# EAGLE design ver1.0 (EAGLE 7.3.0)
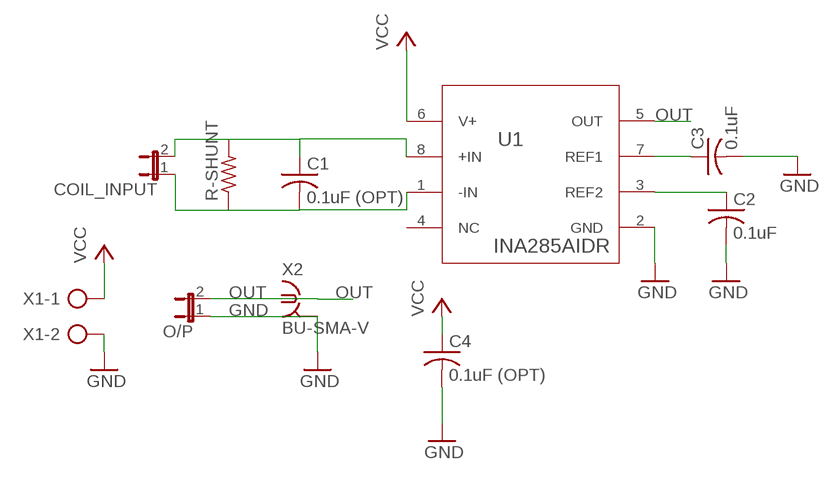
[diagram p0: schematic, sheet 1]

## Parts
C1  0.1uF (OPT)  C-USC0603  [C0603]
C2  0.1uF  C-USC0603  [C0603]
C3  0.1uF  C-USC0603  [C0603]
C4  0.1uF (OPT)  C-USC0603  [C0603]
COIL_INPUT  JP1E  [JP1]
O/P  JP1E  [JP1]
R-SHUNT  R-US_R0603  [R0603]
U1  INA285AIDR  [D0008A_M]
X1  AK500/2  [AK500/2]
X2  BU-SMA-V  [BU-SMA-V]

## Nets
GND: C2.2 C3.2 C4.2 O/P.1 U1.2(GND) X1.2 X2.2 X2.3 X2.4 X2.5
N$1: C2.1 U1.3(REF2)
N$2: C3.1 U1.7(REF1)
N$3: C1.1 COIL_INPUT.2 R-SHUNT.2 U1.8(+IN)
N$4: C1.2 COIL_INPUT.1 R-SHUNT.1 U1.1(-IN)
OUT: O/P.2 U1.5(OUT) X2.1
VCC: C4.1 U1.6(V+) X1.1
Unconnected: U1.4(NC)

## Library data of the parts
C1-C4 = rcl:C-US: CAPACITOR, American symbol
COIL_INPUT O/P = jumper:JP1E: JUMPER
R-SHUNT = rcl:R-US_: RESISTOR, American symbol
U1 = INA285-AID:INA285AIDR
X1 = con-ptr500:AK500/2: CONNECTOR; OC_FARNELL: unknown; OC_NEWARK: unknown
X2 = con-coax:BU-SMA-V: FEMALE SMA CONNECTOR Radiall distributor RS 112-3794; OC_FARNELL: unknown; OC_NEWARK: unknown

## Board
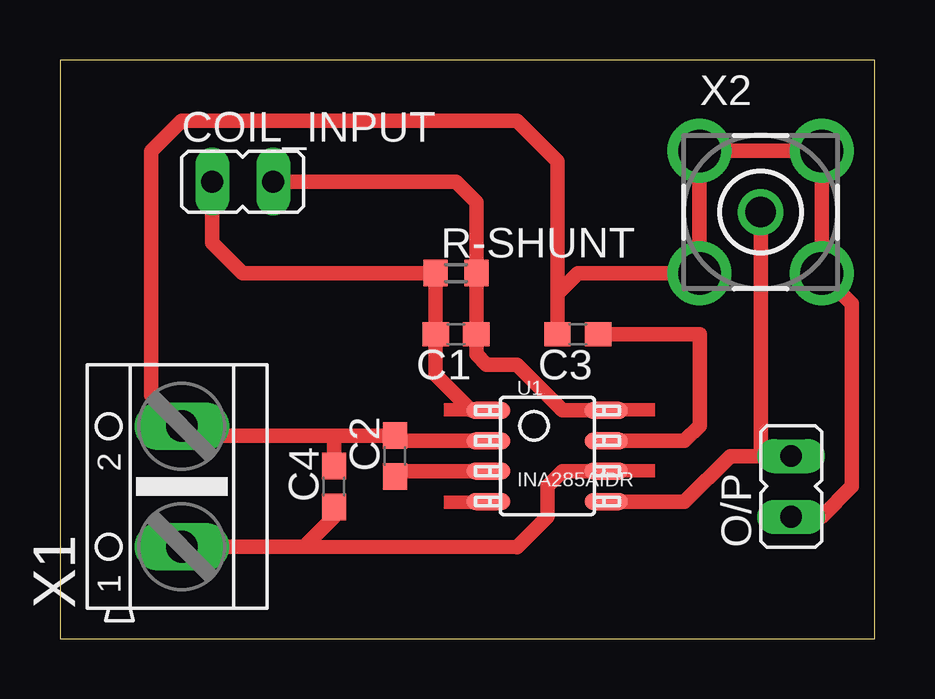
[diagram p1: board, top side]

Size 33.96 x 24.12 mm. Coordinates in mm from the lower left corner, seen from the top.
Outline: 0,0 33.96,0 33.96,24.12 0,24.12 0,0
Copper layers (1*16): Top 0.035mm / dielectric 1.5mm / Bottom 0.035mm
Design rules "default": minimum track width 10mil, minimum drill 24mil, track to track 8mil, track to pad 8mil, pad to pad 8mil, via to via 8mil, smd to smd 8mil, copper to edge 40mil, drill to drill 8mil, minimum pad ring 10mil, minimum via ring 8mil, stop-mask expansion 4mil, vias tented up to drill 0mil, thermal gap 10mil

### Footprints (pad centres in the part's own frame; a part is rotated, then mirrored left to right if it is on the bottom)
C0603 = smd 1.1 x 1: 1 -0.85,0; 2 0.85,0
JP1 = drill 0.914 long: 1 0,-1.27; 2 0,1.27
R0603 = smd 1 x 1.1: 1 -0.85,0; 2 0.85,0
D0008A_M = smd 1.8 x 0.7: 1 -2.45,1.905; 2 -2.45,0.635; 3 -2.45,-0.635; 4 -2.45,-1.905; 5 2.45,-1.905; 6 2.45,-0.635; 7 2.45,0.635; 8 2.45,1.905
AK500/2 = drill 1.321 long: 1 -2.515,0; 2 2.515,0
BU-SMA-V = drill 1.27: 1 0,0 | drill 1.778: 2 -2.55,2.55; 3 2.55,2.55; 4 2.55,-2.55; 5 -2.55,-2.55

### Placement (x,y rotation side)
C1  16.51,12.7 180 top
C2  13.97,7.62 90 top
C3  21.59,12.7 180 top
C4  11.43,6.35 90 top
COIL_INPUT  7.62,19.05 270 top
O/P  30.48,6.35 0 top
R-SHUNT  16.51,15.24 0 top
U1  20.32,7.62 0 top
X1  5.08,6.35 90 top
X2  29.21,17.78 0 top

### Tracks (layer width: path | path; a pad name or v marks a point on that pad's centre or on a via)
GND  (1 unrouted)
  Top 0.406: C3.2 20.74,14.39 | X2.5 | 14.19,8.26 C2.2
  Top 0.61: O/P.1 31.75,5.08 33.02,6.35 33.02,13.97 X2.4 X2.3 X2.2 X2.5 | 20.74,14.39 21.59,15.24 X2.5 | U1.2 14.19,8.26 | C2.2 11.43,8.47 | 11.43,8.47 5.5,8.47 3.81,10.16 3.81,20.32 5.08,21.59 19.05,21.59 20.74,19.9 C3.2 | C4.2 11.43,8.47
N$1
  Top 0.406: 14.19,6.99 C2.1
  Top 0.61: U1.3 14.19,6.99
N$2
  Top 0.61: U1.7 26.04,8.26 26.67,8.89 26.67,12.7 C3.1
N$3
  Top 0.61: COIL_INPUT.2 16.51,19.05 17.36,18.2 R-SHUNT.2 C1.1 17.36,11.85 17.78,11.43 19.05,11.43 20.95,9.53 U1.8
N$4
  Top 0.406: U1.1 17.14,9.53
  Top 0.61: COIL_INPUT.1 6.35,16.51 7.62,15.24 R-SHUNT.1 C1.2 15.66,11.01 17.14,9.53
OUT
  Top 0.61: O/P.2 29.21,7.62 | 29.21,7.62 27.94,7.62 26.04,5.71 U1.5 | X2.1 29.21,7.62
VCC
  Top 0.406: 22.23,6.99 U1.6
  Top 0.61: 22.23,6.99 20.95,6.99 20.32,6.35 20.32,5.08 19.05,3.81 X1.1 10.19,3.83 11.43,5.08 C4.1